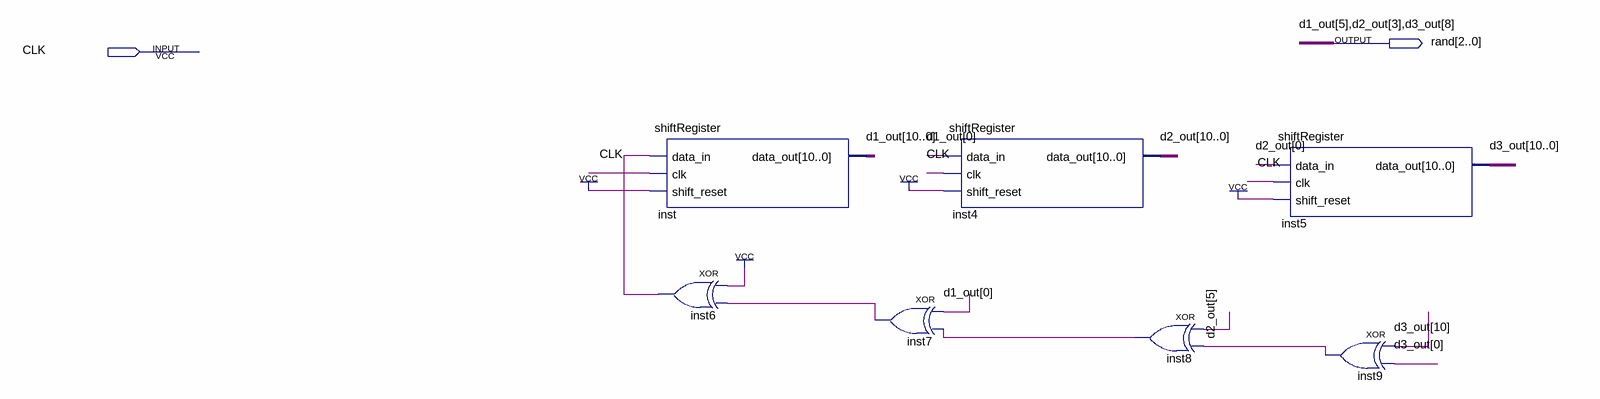
[diagram p0: schematic sheet]
// Quartus schematic XORrandom.bdf as structural Verilog: 7 symbols, 2 pins
module XORrandom (
  input  CLK,
  output [2:0] \rand 
);

  wire inst6_out, inst7_out, inst8_out, inst9_out;
  wire [10:0] d1_out, d2_out, d3_out;

  shiftRegister inst (
    .data_in(inst6_out), .clk(CLK), .shift_reset(1'b1), .data_out({d1_out[10:6], \rand [2], d1_out[4:0]}));
  xor inst6 (inst6_out, 1'b1, inst7_out);
  xor inst7 (inst7_out, d1_out[0], inst8_out);
  shiftRegister inst4 (
    .data_in(d1_out[0]), .clk(CLK), .shift_reset(1'b1), .data_out({d2_out[10:4], \rand [1], d2_out[2:0]}));
  xor inst8 (inst8_out, d2_out[5], inst9_out);
  shiftRegister inst5 (
    .data_in(d2_out[0]), .clk(CLK), .shift_reset(1'b1), .data_out({d3_out[10:9], \rand [0], d3_out[7:0]}));
  xor inst9 (inst9_out, d3_out[10], d3_out[0]);

  // Other names for the same wires on the sheet: d1_out[5] = \rand [2]; d2_out[3] = \rand [1]; d3_out[8] = \rand [0]
endmodule
